# Altium project PRT_STM32F429ZI_Eval-Board.PrjPcb (part 2 of 2)

## Sheet USB.SchDoc: USB
size A4; Revision: 1.0; SheetNumber: 6; SheetTotal: 7
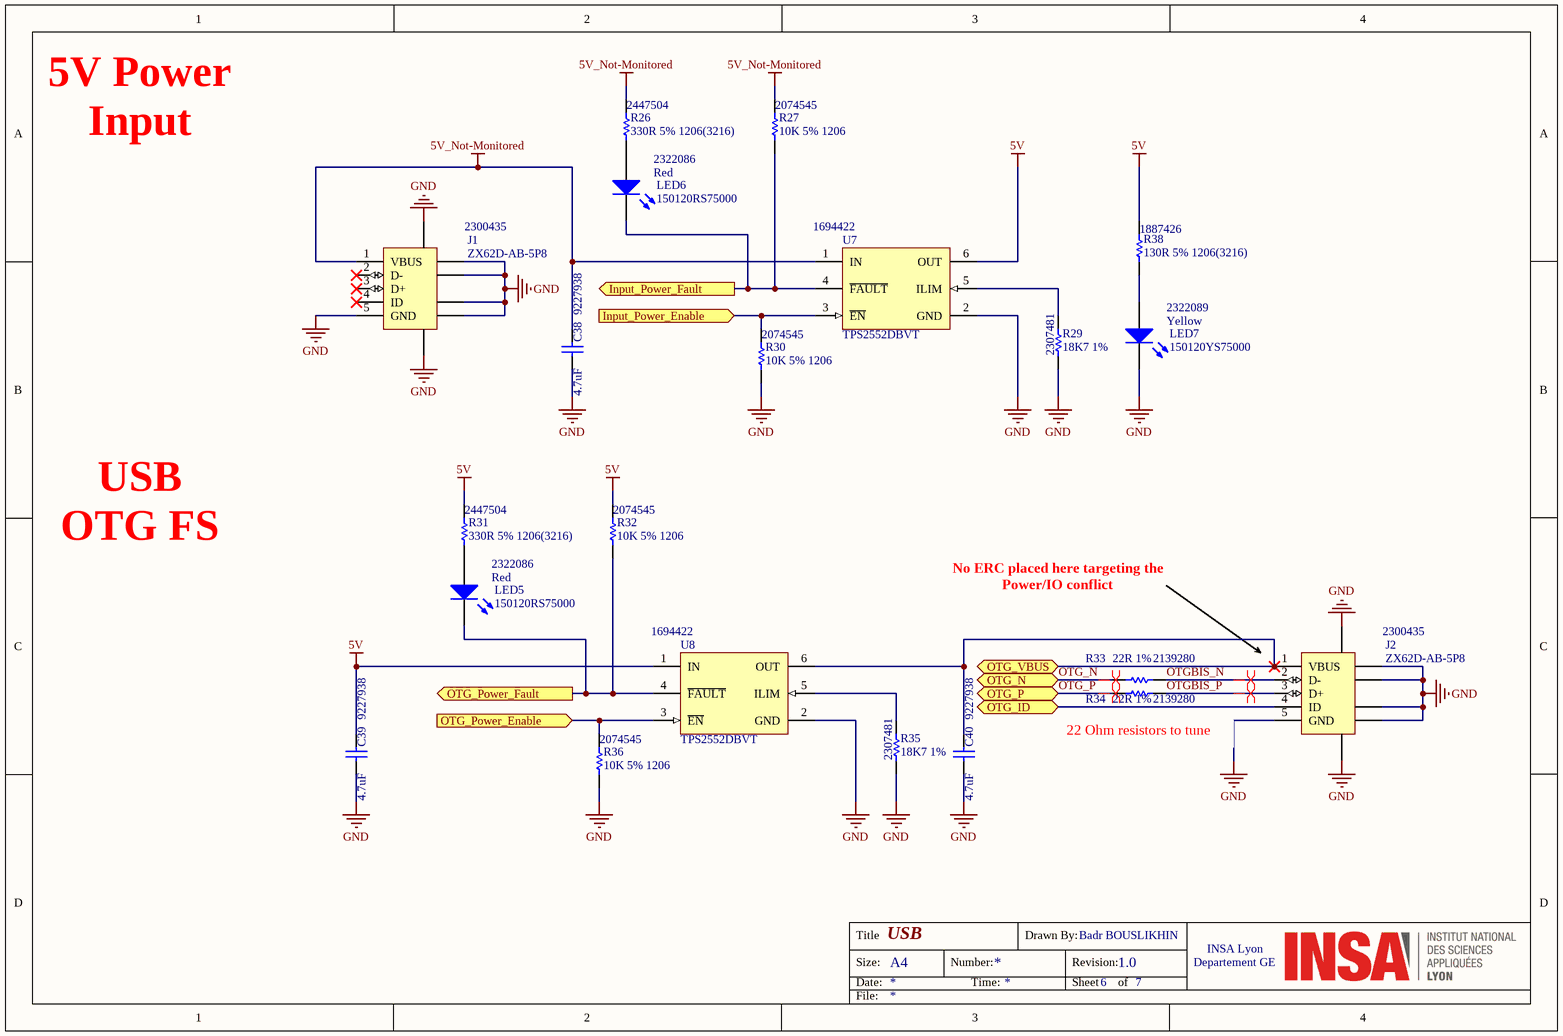
[diagram p6: USB.SchDoc]

### Parts
C38  4.7uF  Supplier Part Number 1: 9227938  [CAPC1206(3216)190_N]
C39  4.7uF  Supplier Part Number 1: 9227938  [CAPC1206(3216)190_N]
C40  4.7uF  Supplier Part Number 1: 9227938  [CAPC1206(3216)190_N]
J1  ZX62D-AB-5P8  Supplier Part Number 1: 2300435  [HIRO-ZX62D-AB-5P8_V]
J2  ZX62D-AB-5P8  Supplier Part Number 1: 2300435  [HIRO-ZX62D-AB-5P8_V]
LED5  150120RS75000  Color: Red  Supplier Part Number 1: 2322086  [1206_A]
LED6  150120RS75000  Color: Red  Supplier Part Number 1: 2322086  [1206_A]
LED7  150120YS75000  Color: Yellow  Supplier Part Number 1: 2322089  [1206_A]
R26  330R 5% 1206(3216)  Supplier Part Number 1: 2447504  [RESC1206(3216)_M]
R27  10K 5% 1206  Supplier Part Number 1: 2074545  [RESC1206(3216)_M]
R29  18K7 1%  Supplier Part Number 1: 2307481  [RESC1206(3216)_L]
R30  10K 5% 1206  Supplier Part Number 1: 2074545  [RESC1206(3216)_M]
R31  330R 5% 1206(3216)  Supplier Part Number 1: 2447504  [RESC1206(3216)_M]
R32  10K 5% 1206  Supplier Part Number 1: 2074545  [RESC1206(3216)_M]
R33  22R 1%  Supplier Part Number 1: 2139280  [RESC0603(1608)_M]
R34  22R 1%  Supplier Part Number 1: 2139280  [RESC0603(1608)_M]
R35  18K7 1%  Supplier Part Number 1: 2307481  [RESC1206(3216)_L]
R36  10K 5% 1206  Supplier Part Number 1: 2074545  [RESC1206(3216)_M]
R38  130R 5% 1206(3216)  Supplier Part Number 1: 1887426  [RESC1206(3216)_L]
U7  TPS2552DBVT  Supplier Part Number 1: 1694422  [DBV6_L]
U8  TPS2552DBVT  Supplier Part Number 1: 1694422  [DBV6_L]

### Ports
Input_Power_Enable (in), Input_Power_Fault (out), OTG_ID, OTG_N, OTG_P, OTG_Power_Enable (in), OTG_Power_Fault (out), OTG_VBUS

### Nets
5V: C39.2 R31.2 R32.2 R38.2 U7.6(OUT) U8.1(IN)
5V_Not-Monitored: C38.2 J1.1(VBUS) R26.2 R27.2 U7.1(IN)
GND: C38.1 C39.1 C40.1 J1.5(GND) J1.6(SHLD) J1.7(SHLD) J1.8(SHLD) J1.9(SHLD) J1.10(SHLD) J1.11(SHLD) J2.5(GND) J2.6(SHLD) J2.7(SHLD) J2.8(SHLD) J2.9(SHLD) J2.10(SHLD) J2.11(SHLD) LED7.1(K) R29.1 R30.1 R35.1 R36.1 U7.2(GND) U8.2(GND)
Input_Power_Enable: R30.2 U7.3(~{EN}) ; port Input_Power_Enable
Input_Power_Fault: LED6.1(K) R27.1 U7.4(~{FAULT}) ; port Input_Power_Fault
OTG_ID: J2.4(ID) ; port OTG_ID
OTG_N: R33.1 ; port OTG_N
OTG_P: R34.1 ; port OTG_P
OTG_Power_Enable: R36.2 U8.3(~{EN}) ; port OTG_Power_Enable
OTG_Power_Fault: LED5.1(K) R32.1 U8.4(~{FAULT}) ; port OTG_Power_Fault
OTG_VBUS: C40.2 J2.1(VBUS) U8.6(OUT) ; port OTG_VBUS
OTGBIS_N: J2.2(D-) R33.2
OTGBIS_P: J2.3(D+) R34.2
NetLED5_2: LED5.2(A) R31.1
NetLED6_2: LED6.2(A) R26.1
NetLED7_2: LED7.2(A) R38.1
NetR29_2: R29.2 U7.5(ILIM)
NetR35_2: R35.2 U8.5(ILIM)

Not connected (* = marked no-connect by the designer): J1 2(D-)* 3(D+)* 4(ID)*

### Layout directives
differential pair: OTG_N, OTG_P, OTGBIS_N, OTGBIS_P

### Notes on the sheet
- 5V Power Input
- USB OTG FS
- No ERC placed here targeting the Power/IO conflict
- 22 Ohm resistors to tune
- Title
- Size:
- Date:
- A4
- Number:
- Time:
- Drawn By:
- Revision:
- Sheet
- Badr BOUSLIKHIN
- of
- Departement GE
- INSA Lyon
- File:

### Library data of the parts
C38-C40 = CMP-1037-04923-1: CAP 4.7uF 50V ±10% 1206 (3216 Metric) Thickness 1.9mm SMD; Case-EIA: 1206; Case-Metric: 3216; Technology: SMT; Rated Voltage: 50 V; Max Thickness: 1.9 mm; Value: 4.7uF; Tolerance: ±10%; Supplier 1: Farnell
J1 J2 = CMP-1349-00001-1: USB 2.0 Standard Micro-USB Connector, Micro AB-Standard (Bottom Mount), 30 V AC, -30 to 85 degC, Right Angle, 5-Pin 7.5 x 5.6 x 2.8 mm SMD, RoHS, Reel; Manufacturer: Hirose Electric; Contact Resistance: 30 mOhm Max.; Number of Contacts: 5; Capacitance: 2 pF Max.; Voltage Rating: 30 V AC; PartNumber: ZX62D-AB-5P8; Mounting Technology: Surface Mount; ComponentLink2Description: Datasheet; DatasheetVersion: Aug-14; RoHS: TRUE; ComponentLink2URL: http://www.hirose.co.jp/cataloge_hp/ed_ZX_20140804.pdf; Packing: Reel; Operating Temperature Range: -30 to 85 degC; PackageDescription: USB Micro-AB Connector, Right Angle, Body 7.5 x 5.6 mm, Pitch 0.65 mm, Height 2.8 mm; ComponentLink1URL: http://www.hirose.com/; ComponentLink1Description: Manufacturer URL; ComponentLink3URL: http://www.hirose.co.jp/cataloge_hp/ed_ZX_20140804.pdf; ComponentLink3Description: Package Specification; Supplier 1: Farnell
LED5 LED6 = CMP-1426-00013-1: SMD mono-color Chip LED, WL-SMCW, Red; Manufacturer: Wuerth Elektronik; ComponentLink2URL: http://katalog.we-online.com/led/datasheet/150120RS75000.pdf; ComponentLink2Description: Datasheet; ComponentLink1Description: Manufacturer URL; ComponentLink1URL: http://www.we-online.com; PartNumber: 150120RS75000; PackageReference: 1206_A; Supplier 1: Farnell
LED7 = CMP-1426-00019-1: SMD mono-color Chip LED, WL-SMCW, Yellow; Manufacturer: Wuerth Elektronik; PackageReference: 1206_A; PartNumber: 150120YS75000; ComponentLink1Description: Manufacturer URL; ComponentLink2URL: http://katalog.we-online.com/led/datasheet/150120YS75000.pdf; ComponentLink2Description: Datasheet; ComponentLink1URL: http://www.we-online.com; Supplier 1: Farnell
R26 R31 = CMP-1014-00062-1: 330R 0.25W 5% 1206 (3216 Metric)  SMD; Case-Metric: 3216; Case-EIA: 1206; Value: 330.00 Ohm; Tolerance: 5 %; Technology: SMT; Power: 0.25 W; Supplier 1: Farnell
R27 R30 R32 R36 = CMP-1014-00098-1: 10K 0.25W 5% 1206 (3216 Metric)  SMD; Manufacturer: YAGEO (PHYCOMP); Manufacturer Part Number: RC1206JR-0710KL; Value: 10000.00 Ohm; Case-Metric: 3216; Case-EIA: 1206; Power: 0.25 W; Tolerance: 5 %; Technology: SMT; RoHS: YES; ComponentLink1URL: http://www.farnell.com/datasheets/444357.pdf; ComponentLink1Description: http://www.farnell.com/datasheets/444357.pdf; ComponentLink2URL: http://www.farnell.com/cad/1539272.zip; ComponentLink2Description: http://www.farnell.com/cad/1539272.zip; Supplier 1: Farnell
R29 R35 = CMP-1014-00652-1: 18K7 0.25W 1% 1206 (3216 Metric)  SMD; Case-EIA: 1206; Case-Metric: 3216; Value: 18700.00 Ohm; Power: 0.25 W; Tolerance: 1 %; Technology: SMT; Supplier 1: Farnell
R33 R34 = CMP-1012-00320-1: 22R 0.1W 1% 0603 (1608 Metric)  SMD; Value: 22.00 Ohm; Case-EIA: 0603; Case-Metric: 1608; Power: 0.1 W; Technology: SMT; Tolerance: 1 %; Supplier 1: Farnell
R38 = CMP-1014-00053-1: 130R 0.25W 5% 1206 (3216 Metric)  SMD; Case-Metric: 3216; Value: 130.00 Ohm; Case-EIA: 1206; Tolerance: 5 %; Technology: SMT; Power: 0.25 W; Supplier 1: Farnell
U7 U8 = CMP-0337-00290-1: Adjustable, Active Low, Constant-Current, Current-Limited Power-Distribution Switch, 0.075 to 1.7 A Current Limit, -40 to 85 degC, 6-pin SOT-23 (DBV), Green (RoHS & no Sb/Br); Manufacturer: Texas Instruments; Vin(Min)(V): 2.5; Current Limit Accuracy @ 1A: +/-7.5% (925mA min / 1075mA max); rDS(on) per FET(Typ)(mOhms): 100/DRV, 85/DBV; Number of Switches: 1; Vin(Max)(V): 6.5; Continuous Current(Max)(A): 1.5; Rating: Catalog; Current Limit Topology: Constant-Current; ComponentLink1URL: http://www.ti.com/general/docs/lit/getliterature.tsp?genericPartNumber=TPS2552&fileType=pdf; ComponentLink1Description: Datasheet; PartNumber: TPS2552DBVT; Code_JEDEC: MO-178-AB*; Current Limit(A): 0.075 to 1.7; Mounting Technology: Surface Mount; PackageReference: DBV6; Eco-Plan: Green (RoHS & no Sb/Br); PackageDescription: 6-Pin Plastic Small-Outline Package, 2.9 x 1.6 mm Body, 0.95 mm Pitch, 2.8 mm Lead Span; Enable: Active Low; DatasheetVersion: SLVS841E; PackageVersion: revK, Mar-2006; Supplier 1: Farnell

## Nets that join several sheets
3V3: STM32F429ZI (30 pins), RAM (15 pins), IO_Peripherals (R1.2 U1.4), Power (5 pins), NOR (8 pins)
5V: IO_Peripherals (5V_Alt..1), Power (9 pins), USB (6 pins)
GND: STM32F429ZI (33 pins), RAM (14 pins), IO_Peripherals (22 pins), Power (12 pins), NOR (C2.1 C3.1 U2.33 U2.52), USB (24 pins)
LED+: IO_Peripherals (U1.2), Power (6 pins)
A0: STM32F429ZI (U6.10), RAM (U5.23), NOR (U2.31)
A1: STM32F429ZI (U6.11), RAM (U5.24), NOR (U2.26)
A2: STM32F429ZI (U6.12), RAM (U5.25), NOR (U2.25)
A3: STM32F429ZI (U6.13), RAM (U5.26), NOR (U2.24)
A4: STM32F429ZI (U6.14), RAM (U5.29), NOR (U2.23)
A5: STM32F429ZI (U6.15), RAM (U5.30), NOR (U2.22)
A6: STM32F429ZI (U6.50), RAM (U5.31), NOR (U2.21)
A7: STM32F429ZI (U6.53), RAM (U5.32), NOR (U2.20)
A8: STM32F429ZI (U6.54), RAM (U5.33), NOR (U2.10)
A9: STM32F429ZI (U6.55), RAM (U5.34), NOR (U2.9)
A10: STM32F429ZI (U6.56), RAM (U5.22), NOR (U2.8)
A11: STM32F429ZI (U6.57), RAM (U5.35), NOR (U2.7)
A12: STM32F429ZI (U6.87), RAM (U5.36), NOR (U2.6)
A13: STM32F429ZI (U6.88), NOR (U2.5)
A14: STM32F429ZI (U6.89), RAM (U5.20), NOR (U2.4)
A15: STM32F429ZI (U6.90), RAM (U5.21), NOR (U2.3)
A16: STM32F429ZI (U6.80), NOR (U2.54)
A17: STM32F429ZI (U6.81), NOR (U2.19)
A18: STM32F429ZI (U6.82), NOR (U2.18)
A19: STM32F429ZI (U6.2), NOR (U2.11)
A20: STM32F429ZI (U6.3), NOR (U2.12)
A21: STM32F429ZI (U6.4), NOR (U2.15)
A22: STM32F429ZI (U6.5), NOR (U2.2)
A23: STM32F429ZI (U6.1), NOR (U2.1)
B2: STM32F429ZI (U6.122), IO_Peripherals (U1.23)
B3: STM32F429ZI (U6.126), IO_Peripherals (U1.24)
B4: STM32F429ZI (U6.127), IO_Peripherals (U1.25)
B5: STM32F429ZI (U6.37), IO_Peripherals (U1.26)
B6: STM32F429ZI (U6.139), IO_Peripherals (U1.27)
B7: STM32F429ZI (U6.140), IO_Peripherals (U1.28)
Backlight_Shutdown: STM32F429ZI (U6.116), Power (R10.1 U3.4)
CAS#: STM32F429ZI (U6.132), RAM (U5.17)
CE#: STM32F429ZI (U6.123), NOR (R6.1 U2.32)
CKE: STM32F429ZI (U6.29), RAM (U5.37)
CLK: STM32F429ZI (U6.93), RAM (U5.38)
CS#: STM32F429ZI (U6.28), RAM (R19.1 U5.19)
DE: STM32F429ZI (U6.22), IO_Peripherals (U1.34)
DISP: STM32F429ZI (U6.100), IO_Peripherals (U1.31)
DQ0: STM32F429ZI (U6.85), RAM (U5.2), NOR (U2.35)
DQ1: STM32F429ZI (U6.86), RAM (U5.5), NOR (U2.37)
DQ2: STM32F429ZI (U6.114), RAM (U5.8), NOR (U2.39)
DQ3: STM32F429ZI (U6.115), RAM (U5.11), NOR (U2.41)
DQ4: STM32F429ZI (U6.58), RAM (U5.44), NOR (U2.44)
DQ5: STM32F429ZI (U6.59), RAM (U5.47), NOR (U2.46)
DQ6: STM32F429ZI (U6.60), RAM (U5.50), NOR (U2.48)
DQ7: STM32F429ZI (U6.63), RAM (U5.53), NOR (U2.50)
DQ8: STM32F429ZI (U6.64), NOR (U2.36)
DQ9: STM32F429ZI (U6.65), NOR (U2.38)
DQ10: STM32F429ZI (U6.66), NOR (U2.40)
DQ11: STM32F429ZI (U6.67), NOR (U2.42)
DQ12: STM32F429ZI (U6.68), NOR (U2.45)
DQ13: STM32F429ZI (U6.77), NOR (U2.47)
DQ14: STM32F429ZI (U6.78), NOR (U2.49)
DQ15: STM32F429ZI (U6.79), NOR (U2.51)
DQM: STM32F429ZI (U6.141), RAM (U5.39)
G2: STM32F429ZI (U6.42), IO_Peripherals (U1.15)
G3: STM32F429ZI (U6.125), IO_Peripherals (U1.16)
G4: STM32F429ZI (U6.69), IO_Peripherals (U1.17)
G5: STM32F429ZI (U6.70), IO_Peripherals (U1.18)
G6: STM32F429ZI (U6.97), IO_Peripherals (U1.19)
G7: STM32F429ZI (U6.117), IO_Peripherals (U1.20)
HSYNC: STM32F429ZI (U6.96), IO_Peripherals (U1.32)
Input_Power_Enable: STM32F429ZI (U6.113), USB (R30.2 U7.3)
Input_Power_Fault: STM32F429ZI (U6.112), USB (LED6.1 R27.1 U7.4)
LED1: STM32F429ZI (U6.44), IO_Peripherals (R37.2)
LED2: STM32F429ZI (U6.45), IO_Peripherals (R28.2)
NOR_OE#: STM32F429ZI (U6.118), NOR (U2.34)
NOR_RESET#: STM32F429ZI (U6.134), NOR (R8.1 U2.14)
NOR_WE#: STM32F429ZI (U6.119), NOR (U2.13)
NRST: STM32F429ZI (U6.25), IO_Peripherals (C1.2 R1.1 SW1.1 SW1.3)
OTG_ID: STM32F429ZI (U6.73), USB (J2.4)
OTG_N: STM32F429ZI (U6.75), USB (R33.1)
OTG_P: STM32F429ZI (U6.76), USB (R34.1)
OTG_Power_Enable: STM32F429ZI (U6.99), USB (R36.2 U8.3)
OTG_Power_Fault: STM32F429ZI (U6.98), USB (LED5.1 R32.1 U8.4)
OTG_VBUS: STM32F429ZI (U6.74), USB (C40.2 J2.1 U8.6)
PA4: STM32F429ZI (U6.40), IO_Peripherals (U1.33)
PA11: STM32F429ZI (U6.103), IO_Peripherals (U1.9)
PA12: STM32F429ZI (U6.104), IO_Peripherals (U1.10)
PA13: STM32F429ZI (U6.105), IO_Peripherals (SWD.1)
PA14: STM32F429ZI (U6.109), IO_Peripherals (SWD.2)
PB0: STM32F429ZI (U6.46), IO_Peripherals (U1.8)
PB1: STM32F429ZI (U6.47), IO_Peripherals (U1.11)
PC0: STM32F429ZI (U6.26), RAM (U5.16)
PC10: STM32F429ZI (U6.111), IO_Peripherals (U1.7)
PCLK: STM32F429ZI (U6.92), IO_Peripherals (U1.30)
PF11: STM32F429ZI (U6.49), RAM (U5.18)
PG6: STM32F429ZI (U6.91), IO_Peripherals (U1.12)
RY/BY#: STM32F429ZI (R22.2), NOR (R7.1 U2.17)

## Assembly variants
Cheap: not fitted SW3